# Altium schematic sheet MicroMultimeter_EXP_Sch.SchDoc: MicroMultimeter - EXP
size 127 x 101 mm; Author: Hom; CompanyName: KitSprout; DrawnBy: Hom; Engineer: Hom; Organization: KitSprout; Revision: A; SheetNumber: 1; SheetTotal: 1; License: CC BY-SA 4.0; Version: 1.0; LibVersion: 1.4; PageSetup: Record=PageOptions|CenterHorizontal=True|CenterVertical=True|PrintScale=1.00|XCorrection=1.00|YCorrection=1.00|PrintKind=0|BorderSize=5000000|LeftOffset=0|BottomOffset=0|Orientation=2|PaperLength=1000|PaperWidth=1000|Scale=100|PaperSource=7|PrintQuality=-3|MediaType=1|DitherType=10|PrintScaleMode=0|PaperKind=A4|PaperIndex=9
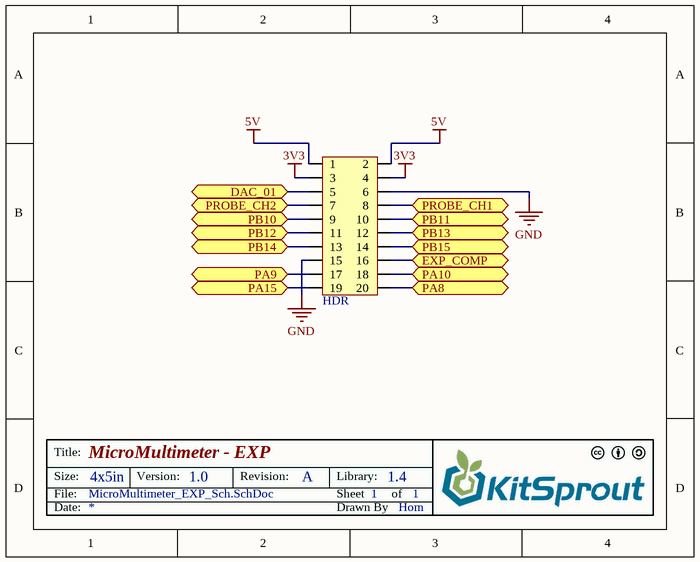
[diagram p0: MicroMultimeter_EXP_Sch.SchDoc]

## Parts
HDR  HDR2x10_2.54  [HDR2X10_2.54_180HF]  (value not drawn)

## Ports
DAC_01, EXP_COMP, PA8, PA9, PA10, PA15, PB10, PB11, PB12, PB13, PB14, PB15, PROBE_CH1, PROBE_CH2

## Nets
3V3: HDR.3 HDR.4
5V: HDR.1 HDR.2
GND: HDR.6 HDR.15
DAC_01: HDR.5 ; port DAC_01
EXP_COMP: HDR.16 ; port EXP_COMP
PA8: HDR.20 ; port PA8
PA9: HDR.17 ; port PA9
PA10: HDR.18 ; port PA10
PA15: HDR.19 ; port PA15
PB10: HDR.9 ; port PB10
PB11: HDR.10 ; port PB11
PB12: HDR.11 ; port PB12
PB13: HDR.12 ; port PB13
PB14: HDR.13 ; port PB14
PB15: HDR.14 ; port PB15
PROBE_CH1: HDR.8 ; port PROBE_CH1
PROBE_CH2: HDR.7 ; port PROBE_CH2

## Notes on the sheet
- Title:
- Size:
- Date:
- File:
- 4x5in
- Version:
- Revision:
- Sheet
- Drawn By
- Library:
- of

## Library data of the parts
HDR = HDR2x10_2.54: Header